# Altium schematic sheet PING2_PCB.SchDoc
size A2; SheetNumber: 1; SheetTotal: 1
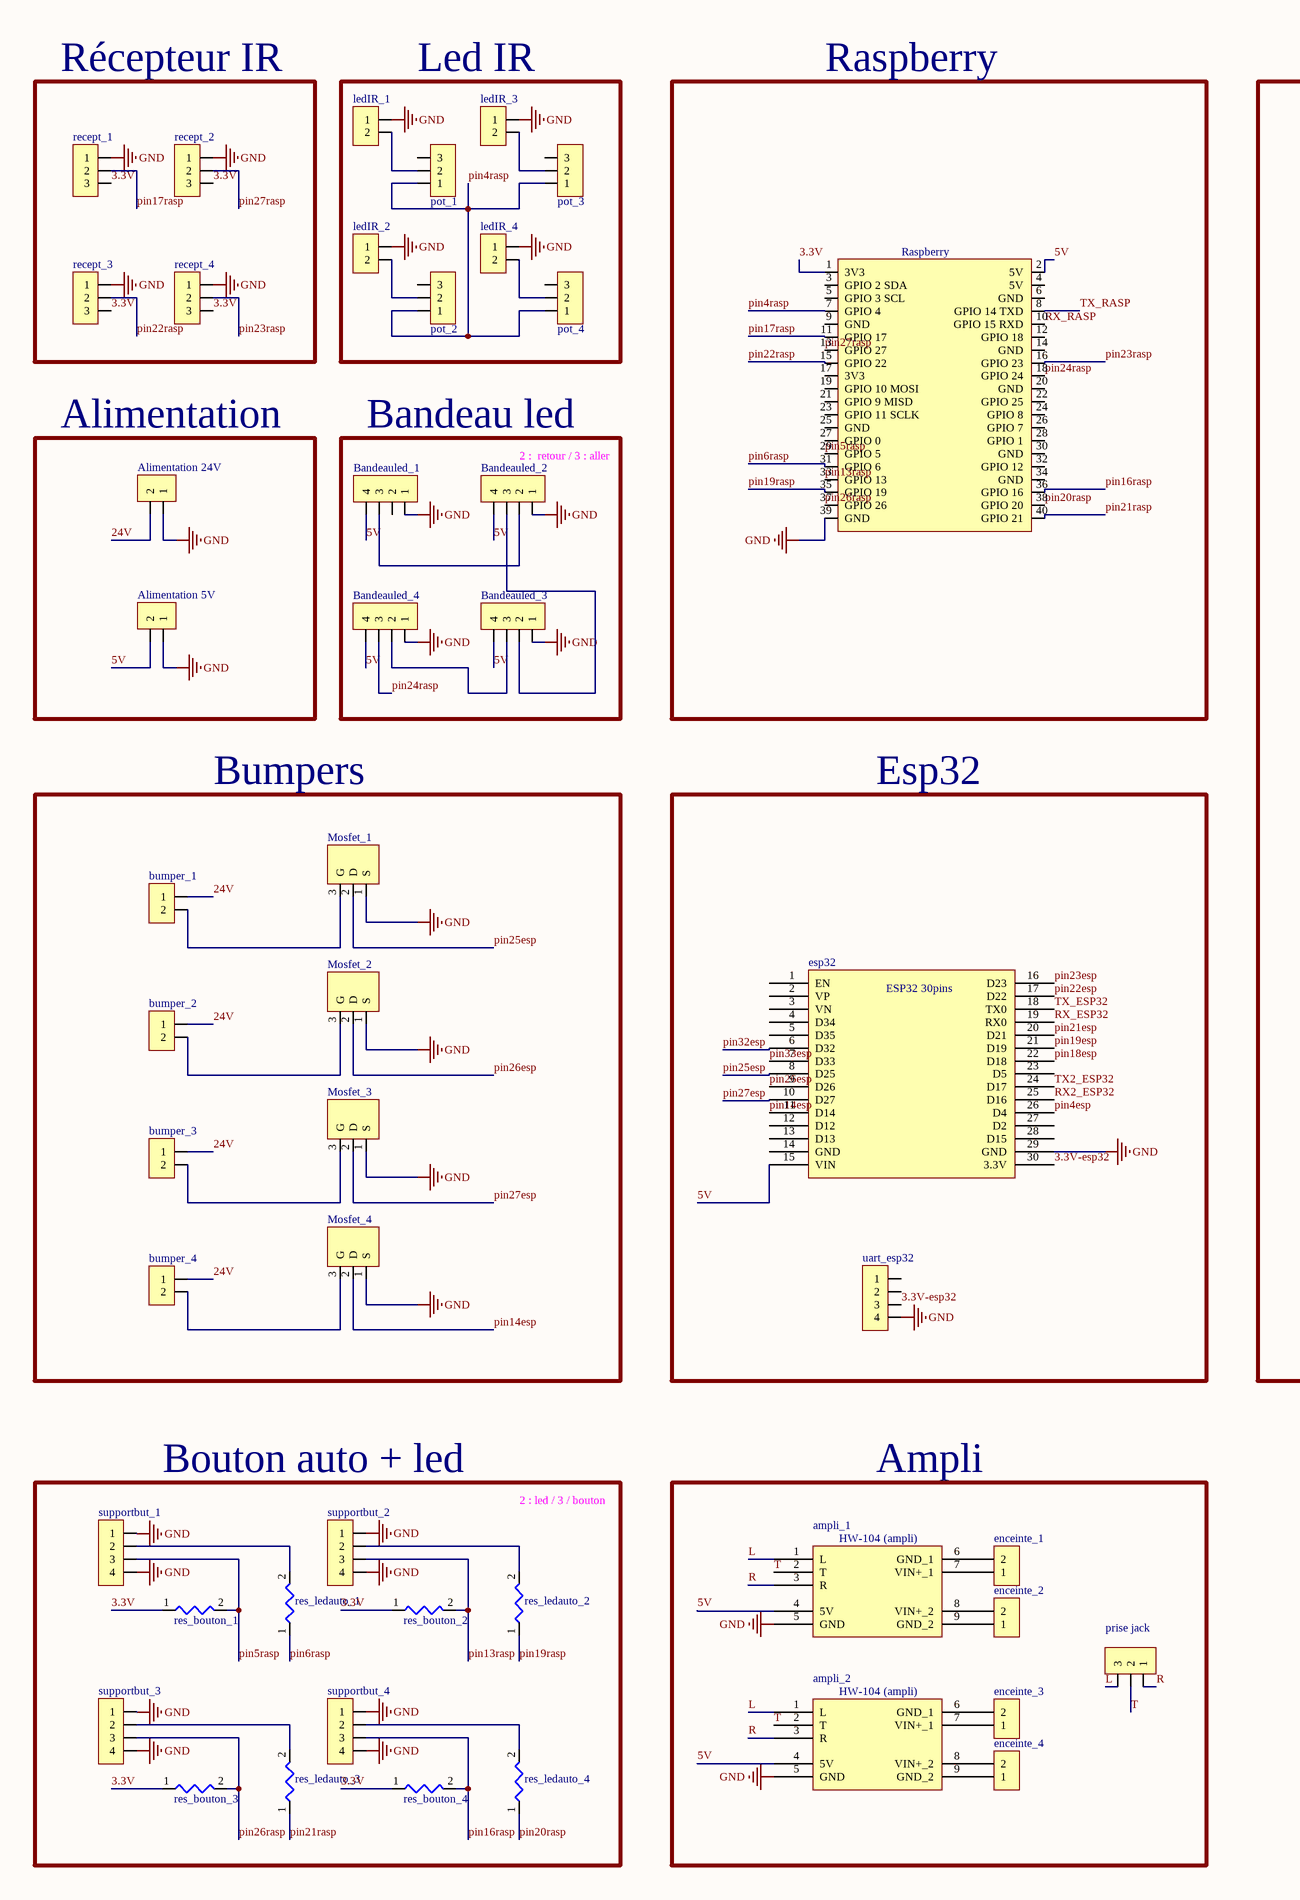
[diagram p0: PING2_PCB.SchDoc, left]
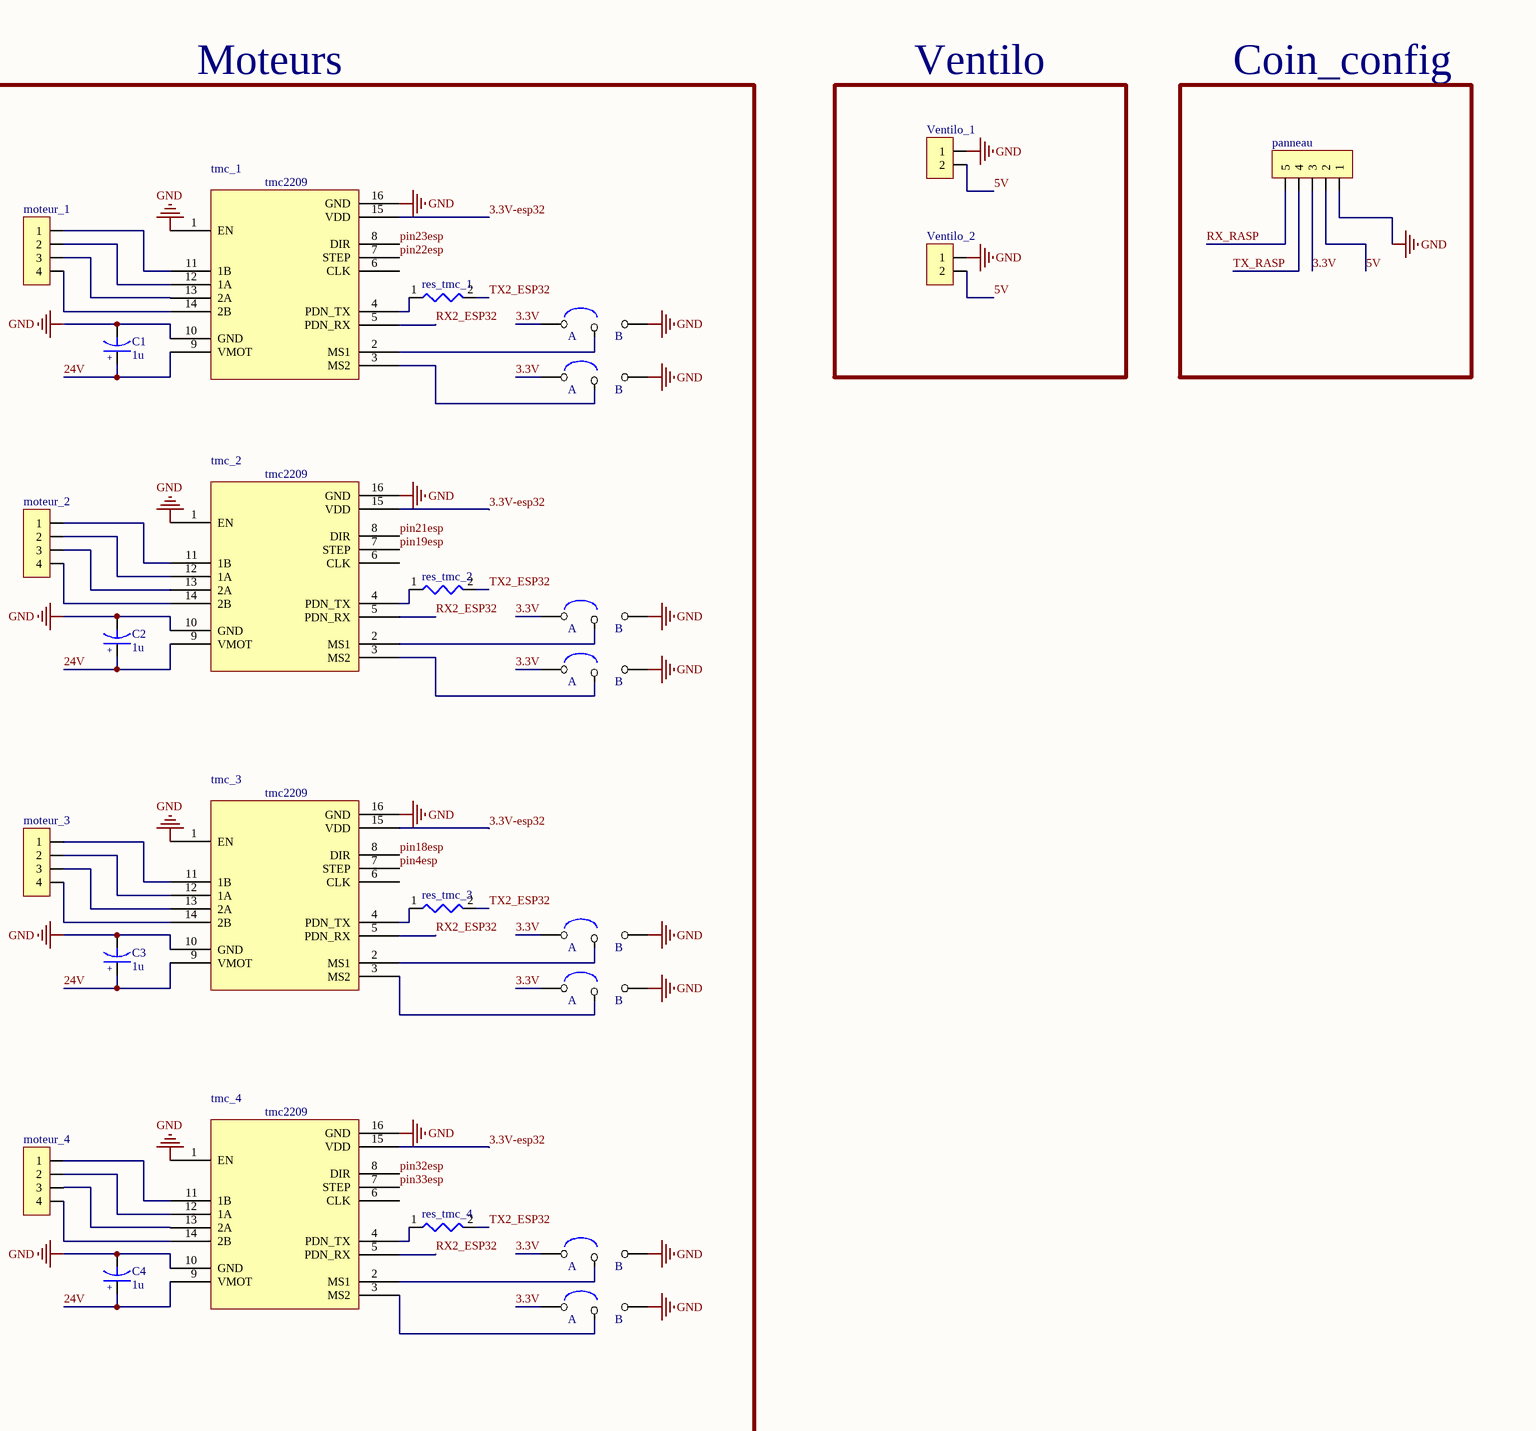
[diagram p1: PING2_PCB.SchDoc, right]

## Parts
Alimentation_5V  Header_2  [Header_2]  (value not drawn)
Alimentation_24V  Header_2  [Header_2]  (value not drawn)
ampli_1  HW-104 (ampli)  [HW-104 (ampli)]  (value not drawn)
ampli_2  HW-104 (ampli)  [HW-104 (ampli)]  (value not drawn)
Bandeauled_1  Header_4  [Header_4]  (value not drawn)
Bandeauled_2  Header_4  [Header_4]  (value not drawn)
Bandeauled_3  Header_4  [Header_4]  (value not drawn)
Bandeauled_4  Header_4  [Header_4]  (value not drawn)
bumper_1  Header_2  [Header_2]  (value not drawn)
bumper_2  Header_2  [Header_2]  (value not drawn)
bumper_3  Header_2  [Header_2]  (value not drawn)
bumper_4  Header_2  [Header_2]  (value not drawn)
C1  value 1u  [RB.2/.4]  (hidden comment: CAP_POL)
C2  value 1u  [RB.2/.4]  (hidden comment: CAP_POL)
C3  value 1u  [RB.2/.4]  (hidden comment: CAP_POL)
C4  value 1u  [RB.2/.4]  (hidden comment: CAP_POL)
enceinte_1  Header_2  [Header_2]  (value not drawn)
enceinte_2  Header_2  [Header_2]  (value not drawn)
enceinte_3  Header_2  [Header_2]  (value not drawn)
enceinte_4  Header_2  [Header_2]  (value not drawn)
esp32  esp32-30pins  [esp32-30pins]  (value not drawn)
JMP11  JUMPER3  [JMP3-100]  (value not drawn)
JMP12  JUMPER3  [JMP3-100]  (value not drawn)
JMP21  JUMPER3  [JMP3-100]  (value not drawn)
JMP22  JUMPER3  [JMP3-100]  (value not drawn)
JMP31  JUMPER3  [JMP3-100]  (value not drawn)
JMP32  JUMPER3  [JMP3-100]  (value not drawn)
JMP41  JUMPER3  [JMP3-100]  (value not drawn)
JMP42  JUMPER3  [JMP3-100]  (value not drawn)
ledIR_1  Header_2  [Header_2]  (value not drawn)
ledIR_2  Header_2  [Header_2]  (value not drawn)
ledIR_3  Header_2  [Header_2]  (value not drawn)
ledIR_4  Header_2  [Header_2]  (value not drawn)
Mosfet_1  Mosfet  [Mosfet]  (value not drawn)
Mosfet_2  Mosfet  [Mosfet]  (value not drawn)
Mosfet_3  Mosfet  [Mosfet]  (value not drawn)
Mosfet_4  Mosfet  [Mosfet]  (value not drawn)
moteur_1  Header_4  [Header_4]  (value not drawn)
moteur_2  Header_4  [Header_4]  (value not drawn)
moteur_3  Header_4  [Header_4]  (value not drawn)
moteur_4  Header_4  [Header_4]  (value not drawn)
panneau  Header_5  [Header_5]  (value not drawn)
pot_1  potentiometre_variable  [Potentiometre_variable]  (value not drawn)
pot_2  potentiometre_variable  [Potentiometre_variable]  (value not drawn)
pot_3  potentiometre_variable  [Potentiometre_variable]  (value not drawn)
pot_4  potentiometre_variable  [Potentiometre_variable]  (value not drawn)
prise_jack  Header_3  [Header_3]  (value not drawn)
Raspberry  raspberry_3B+  [raspberry_3b+]  (value not drawn)
recept_1  Header_3  [Header_3]  (value not drawn)
recept_2  Header_3  [Header_3]  (value not drawn)
recept_3  Header_3  [Header_3]  (value not drawn)
recept_4  Header_3  [Header_3]  (value not drawn)
res_bouton_1  resistance  [resistance]  (value not drawn)
res_bouton_2  resistance  [resistance]  (value not drawn)
res_bouton_3  resistance  [resistance]  (value not drawn)
res_bouton_4  resistance  [resistance]  (value not drawn)
res_ledauto_1  resistance  [resistance]  (value not drawn)
res_ledauto_2  resistance  [resistance]  (value not drawn)
res_ledauto_3  resistance  [resistance]  (value not drawn)
res_ledauto_4  resistance  [resistance]  (value not drawn)
res_tmc_1  resistance  [resistance]  (value not drawn)
res_tmc_2  resistance  [resistance]  (value not drawn)
res_tmc_3  resistance  [resistance]  (value not drawn)
res_tmc_4  resistance  [resistance]  (value not drawn)
supportbut_1  Header_4  [Header_4]  (value not drawn)
supportbut_2  Header_4  [Header_4]  (value not drawn)
supportbut_3  Header_4  [Header_4]  (value not drawn)
supportbut_4  Header_4  [Header_4]  (value not drawn)
tmc_1  tmc2209  [tmc2209]  (value not drawn)
tmc_2  tmc2209  [tmc2209]  (value not drawn)
tmc_3  tmc2209  [tmc2209]  (value not drawn)
tmc_4  tmc2209  [tmc2209]  (value not drawn)
uart_esp32  Header_4  [Header_4]  (value not drawn)
Ventilo_1  Header_2  [Header_2]  (value not drawn)
Ventilo_2  Header_2  [Header_2]  (value not drawn)

## Blocks framed on the sheet
Récepteur IR: recept_1-recept_4
Led IR: ledIR_1-ledIR_4 pot_1-pot_4
Raspberry: Raspberry
Moteurs: C1-C4 JMP11 JMP12 JMP21 JMP22 JMP31 JMP32 JMP41 JMP42 moteur_1-moteur_4 res_tmc_1-res_tmc_4 tmc_1-tmc_4
Ventilo: Ventilo_1 Ventilo_2
Coin_config: panneau
Alimentation: Alimentation_5V Alimentation_24V
Bandeau led: Bandeauled_1-Bandeauled_4
Bumpers: bumper_1-bumper_4 Mosfet_1-Mosfet_4
Esp32: esp32 uart_esp32
Bouton auto + led: res_bouton_1-res_bouton_4 res_ledauto_1-res_ledauto_4 supportbut_1-supportbut_4
Ampli: ampli_1 ampli_2 enceinte_1-enceinte_4 prise_jack

## Nets
GND: Alimentation_5V.1 Alimentation_24V.1 ampli_1.5(GND) ampli_2.5(GND) Bandeauled_1.1 Bandeauled_2.1 Bandeauled_3.1 Bandeauled_4.1 C1.2 C2.2 C3.2 C4.2 esp32.29(GND) JMP11.2 JMP12.2 JMP21.2 JMP22.2 JMP31.2 JMP32.2 JMP41.2 JMP42.2 ledIR_1.1 ledIR_2.1 ledIR_3.1 ledIR_4.1 Mosfet_1.1(S) Mosfet_2.1(S) Mosfet_3.1(S) Mosfet_4.1(S) panneau.1 Raspberry.39(GND) recept_1.1 recept_2.1 recept_3.1 recept_4.1 supportbut_1.1 supportbut_1.4 supportbut_2.1 supportbut_2.4 supportbut_3.1 supportbut_3.4 supportbut_4.1 supportbut_4.4 tmc_1.1(EN) tmc_1.10(GND) tmc_1.16(GND) tmc_2.1(EN) tmc_2.10(GND) tmc_2.16(GND) tmc_3.1(EN) tmc_3.10(GND) tmc_3.16(GND) tmc_4.1(EN) tmc_4.10(GND) tmc_4.16(GND) uart_esp32.4 Ventilo_1.1 Ventilo_2.1
3.3V: JMP11.1 JMP12.1 JMP21.1 JMP22.1 JMP31.1 JMP32.1 JMP41.1 JMP42.1 panneau.3 Raspberry.1(3V3) recept_1.3 recept_2.3 recept_3.3 recept_4.3 res_bouton_1.1 res_bouton_2.1 res_bouton_3.1 res_bouton_4.1
3.3V-esp32: esp32.30(3.3V) tmc_1.15(VDD) tmc_2.15(VDD) tmc_3.15(VDD) tmc_4.15(VDD) uart_esp32.3
5V: Alimentation_5V.2 ampli_1.4(5V) ampli_2.4(5V) Bandeauled_1.4 Bandeauled_2.4 Bandeauled_3.4 Bandeauled_4.4 esp32.15(VIN) panneau.2 Raspberry.2(5V) Ventilo_1.2 Ventilo_2.2
24V: Alimentation_24V.2 bumper_1.1 bumper_2.1 bumper_3.1 bumper_4.1 C1.1 C2.1 C3.1 C4.1 tmc_1.9(VMOT) tmc_2.9(VMOT) tmc_3.9(VMOT) tmc_4.9(VMOT)
L: ampli_1.1(L) ampli_2.1(L) prise_jack.3
pin4esp: esp32.26(D4) tmc_3.7(STEP)
pin4rasp: pot_1.1 pot_2.1 pot_3.1 pot_4.1 Raspberry.7(GPIO_4)
pin5rasp: Raspberry.29(GPIO_5) res_bouton_1.2 supportbut_1.3
pin6rasp: Raspberry.31(GPIO_6) res_ledauto_1.1
pin13rasp: Raspberry.33(GPIO_13) res_bouton_2.2 supportbut_2.3
pin14esp: esp32.11(D14) Mosfet_4.2(D)
pin16rasp: Raspberry.36(GPIO_16) res_bouton_4.2 supportbut_4.3
pin17rasp: Raspberry.11(GPIO_17) recept_1.2
pin18esp: esp32.22(D18) tmc_3.8(DIR)
pin19esp: esp32.21(D19) tmc_2.7(STEP)
pin19rasp: Raspberry.35(GPIO_19) res_ledauto_2.1
pin20rasp: Raspberry.38(GPIO_20) res_ledauto_4.1
pin21esp: esp32.20(D21) tmc_2.8(DIR)
pin21rasp: Raspberry.40(GPIO_21) res_ledauto_3.1
pin22esp: esp32.17(D22) tmc_1.7(STEP)
pin22rasp: Raspberry.15(GPIO_22) recept_3.2
pin23esp: esp32.16(D23) tmc_1.8(DIR)
pin23rasp: Raspberry.16(GPIO_23) recept_4.2
pin24rasp: Bandeauled_4.3 Raspberry.18(GPIO_24)
pin25esp: esp32.8(D25) Mosfet_1.2(D)
pin26esp: esp32.9(D26) Mosfet_2.2(D)
pin26rasp: Raspberry.37(GPIO_26) res_bouton_3.2 supportbut_3.3
pin27esp: esp32.10(D27) Mosfet_3.2(D)
pin27rasp: Raspberry.13(GPIO_27) recept_2.2
pin32esp: esp32.6(D32) tmc_4.8(DIR)
pin33esp: esp32.7(D33) tmc_4.7(STEP)
R: ampli_1.3(R) ampli_2.3(R) prise_jack.1
RX2_ESP32: esp32.25(D16) tmc_1.5(PDN_RX) tmc_2.5(PDN_RX) tmc_3.5(PDN_RX) tmc_4.5(PDN_RX)
RX_ESP32: esp32.19(RX0)
RX_RASP: panneau.5 Raspberry.10(GPIO_15_RXD)
T: ampli_1.2(T) ampli_2.2(T) prise_jack.2
TX2_ESP32: esp32.24(D17) res_tmc_1.2 res_tmc_2.2 res_tmc_3.2 res_tmc_4.2
TX_ESP32: esp32.18(TX0)
TX_RASP: panneau.4 Raspberry.8(GPIO_14_TXD)
Netampli_1_6: ampli_1.6(GND_1) enceinte_1.2
Netampli_1_7: ampli_1.7(VIN+_1) enceinte_1.1
Netampli_1_8: ampli_1.8(VIN+_2) enceinte_2.2
Netampli_1_9: ampli_1.9(GND_2) enceinte_2.1
Netampli_2_6: ampli_2.6(GND_1) enceinte_3.2
Netampli_2_7: ampli_2.7(VIN+_1) enceinte_3.1
Netampli_2_8: ampli_2.8(VIN+_2) enceinte_4.2
Netampli_2_9: ampli_2.9(GND_2) enceinte_4.1
NetBandeauled_1_3: Bandeauled_1.3 Bandeauled_2.2
NetBandeauled_2_3: Bandeauled_2.3 Bandeauled_3.2
NetBandeauled_3_3: Bandeauled_3.3 Bandeauled_4.2
Netbumper_1_2: bumper_1.2 Mosfet_1.3(G)
Netbumper_2_2: bumper_2.2 Mosfet_2.3(G)
Netbumper_3_2: bumper_3.2 Mosfet_3.3(G)
Netbumper_4_2: bumper_4.2 Mosfet_4.3(G)
NetJMP11_3: JMP11.3 tmc_1.2(MS1)
NetJMP12_3: JMP12.3 tmc_1.3(MS2)
NetJMP21_3: JMP21.3 tmc_2.2(MS1)
NetJMP22_3: JMP22.3 tmc_2.3(MS2)
NetJMP31_3: JMP31.3 tmc_3.2(MS1)
NetJMP32_3: JMP32.3 tmc_3.3(MS2)
NetJMP41_3: JMP41.3 tmc_4.2(MS1)
NetJMP42_3: JMP42.3 tmc_4.3(MS2)
NetledIR_1_2: ledIR_1.2 pot_1.2
NetledIR_2_2: ledIR_2.2 pot_2.2
NetledIR_3_2: ledIR_3.2 pot_3.2
NetledIR_4_2: ledIR_4.2 pot_4.2
Netmoteur_1_1: moteur_1.1 tmc_1.11(1B)
Netmoteur_1_2: moteur_1.2 tmc_1.12(1A)
Netmoteur_1_3: moteur_1.3 tmc_1.13(2A)
Netmoteur_1_4: moteur_1.4 tmc_1.14(2B)
Netmoteur_2_1: moteur_2.1 tmc_2.11(1B)
Netmoteur_2_2: moteur_2.2 tmc_2.12(1A)
Netmoteur_2_3: moteur_2.3 tmc_2.13(2A)
Netmoteur_2_4: moteur_2.4 tmc_2.14(2B)
Netmoteur_3_1: moteur_3.1 tmc_3.11(1B)
Netmoteur_3_2: moteur_3.2 tmc_3.12(1A)
Netmoteur_3_3: moteur_3.3 tmc_3.13(2A)
Netmoteur_3_4: moteur_3.4 tmc_3.14(2B)
Netmoteur_4_1: moteur_4.1 tmc_4.11(1B)
Netmoteur_4_2: moteur_4.2 tmc_4.12(1A)
Netmoteur_4_3: moteur_4.3 tmc_4.13(2A)
Netmoteur_4_4: moteur_4.4 tmc_4.14(2B)
Netres_ledauto_1_2: res_ledauto_1.2 supportbut_1.2
Netres_ledauto_2_2: res_ledauto_2.2 supportbut_2.2
Netres_ledauto_3_2: res_ledauto_3.2 supportbut_3.2
Netres_ledauto_4_2: res_ledauto_4.2 supportbut_4.2
Netres_tmc_1_1: res_tmc_1.1 tmc_1.4(PDN_TX)
Netres_tmc_2_1: res_tmc_2.1 tmc_2.4(PDN_TX)
Netres_tmc_3_1: res_tmc_3.1 tmc_3.4(PDN_TX)
Netres_tmc_4_1: res_tmc_4.1 tmc_4.4(PDN_TX)

Not connected (* = marked no-connect by the designer): Bandeauled_1 2; esp32 1(EN) 2(VP) 3(VN) 4(D34) 5(D35) 12(D12) 13(D13) 14(GND) 23(D5) 27(D2) 28(D15); pot_1 3; pot_2 3; pot_3 3; pot_4 3; Raspberry 3(GPIO_2_SDA) 4(5V) 5(GPIO_3_SCL) 6(GND) 9(GND) 12(GPIO_18) 14(GND) 17(3V3) 19(GPIO_10_MOSI) 20(GND) 21(GPIO_9_MISD) 22(GPIO_25) 23(GPIO_11_SCLK) 24(GPIO_8) 25(GND) 26(GPIO_7) 27(GPIO_0) 28(GPIO_1) 30(GND) 32(GPIO_12) 34(GND); tmc_1 6(CLK); tmc_2 6(CLK); tmc_3 6(CLK); tmc_4 6(CLK); uart_esp32 1 2

## Notes on the sheet
- (near Bandeauled_2) 2 :  retour / 3 : aller
- 2 : led / 3 / bouton
- (in symbol CAP_POL) +
- (in symbol esp32-30pins) ESP32 30pins
- (in symbol JUMPER3) A; B

## Library data of the parts
C1-C4 = CAP_POL: capacité polarisée
JMP11 JMP12 JMP21 JMP22 JMP31 JMP32 JMP41 JMP42 = JUMPER3: cavalier 2 positions